# Altium schematic sheet Interface.SchDoc
size A; SheetNumber: 3; SheetTotal: 4
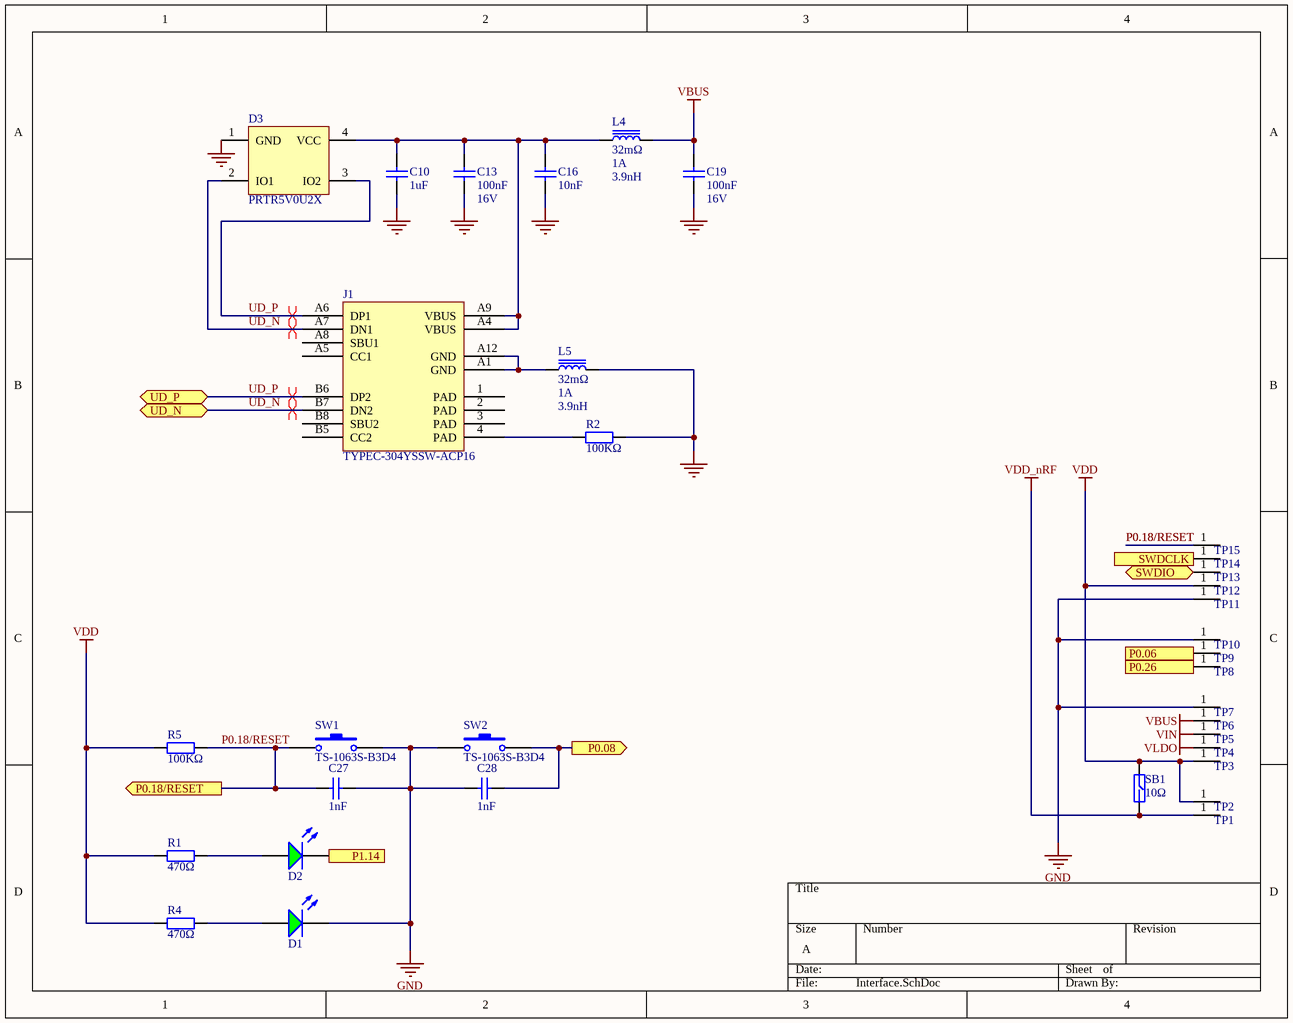
[diagram p0: Interface.SchDoc]

## Parts
C10  value 1uF  [0603_C]  (hidden comment: 1uF (105) 10% 50V)
C13  value 100nF  Voltage: 16V  [0402_C]  (hidden comment: 100nF (104) 10% 16V)
C16  value 10nF  [0402_C]  (hidden comment: 10nF (103) 10% 50V)
C19  value 100nF  Voltage: 16V  [0402_C]  (hidden comment: 100nF (104) 10% 16V)
C27  value 1nF  [0402_C]  (hidden comment: 1nF (102) 10% 50V)
C28  value 1nF  [0402_C]  (hidden comment: 1nF (102) 10% 50V)
D1  0603 LED Green  [0603_LED_S1]  (value not drawn)
D2  0603 LED Green  [0603_LED_S1]  (value not drawn)
D3  PRTR5V0U2X  [SOT190P230X110-4L]
J1  TYPEC-304YSSW-ACP16  [TYPEC-304YSSW-ACP16]
L4  value 3.9nH  DC Resistance: 32mΩ  Current: 1A  [0603_L]  (hidden comment: LQW18AN3N9C10D)
L5  value 3.9nH  DC Resistance: 32mΩ  Current: 1A  [0603_L]  (hidden comment: LQW18AN3N9C10D)
R1  value 470Ω  [0402_R]  (hidden comment: 470Ω (4700) ±1%)
R2  value 100KΩ  [0402_R]  (hidden comment: 100KΩ (1003) ±1%)
R4  value 470Ω  [0402_R]  (hidden comment: 470Ω (4700) ±1%)
R5  value 100KΩ  [0402_R]  (hidden comment: 100KΩ (1003) ±1%)
SB1  10Ω  [0603-FUSE]
SW1  TS-1063S-B3D4  [TS-1063S-B3D4]
SW2  TS-1063S-B3D4  [TS-1063S-B3D4]
TP1  Test Point  [TP_H_24_80_36]  (value not drawn)  (net tie, no BOM)
TP2  Test Point  [TP_H_24_80_36]  (value not drawn)  (net tie, no BOM)
TP3  Test Point  [TP_H_24_80_36]  (value not drawn)  (net tie, no BOM)
TP4  Test Point  [TP_H_24_80_36]  (value not drawn)  (net tie, no BOM)
TP5  Test Point  [TP_H_24_80_36]  (value not drawn)  (net tie, no BOM)
TP6  Test Point  [TP_H_24_80_36]  (value not drawn)  (net tie, no BOM)
TP7  Test Point  [TP_H_24_80_36]  (value not drawn)  (net tie, no BOM)
TP8  Test Point  [TP_H_24_80_36]  (value not drawn)  (net tie, no BOM)
TP9  Test Point  [TP_H_24_80_36]  (value not drawn)  (net tie, no BOM)
TP10  Test Point  [TP_H_24_80_36]  (value not drawn)  (net tie, no BOM)
TP11  Test Point  [TP_H_24_80_36]  (value not drawn)  (net tie, no BOM)
TP12  Test Point  [TP_H_24_80_36]  (value not drawn)  (net tie, no BOM)
TP13  Test Point  [TP_H_24_80_36]  (value not drawn)  (net tie, no BOM)
TP14  Test Point  [TP_H_24_80_36]  (value not drawn)  (net tie, no BOM)
TP15  Test Point  [TP_H_24_80_36]  (value not drawn)  (net tie, no BOM)

## Ports
P0.06 (out, see Collection[3D], Controller[1B]), P0.08 (out, see Collection[3D], Controller[1B]), P0.18/RESET (out, see Collection[2D], Controller[2C]), P0.26 (in, see Collection[3D], Controller[1B]), P1.14 (in, see Collection[3D], Controller[2A]), SWDCLK (out, see Collection[2D], Controller[3C]), SWDIO (bidir, see Collection[2D], Controller[3C]), UD_N (bidir, see Collection[2D]), UD_P (bidir, see Collection[2D])

## Nets
GND: C10.1 C13.1 C16.1 C19.1 C27.2 C28.1 D1.K D3.1(GND) L5.2 R2.2 SW1.2 SW2.1 TP7.1(TP) TP10.1(TP) TP11.1(TP)
VBUS: C19.2 L4.2 TP6.1(TP)
VDD: R1.1 R4.1 R5.1 SB1.1 TP2.1(TP) TP3.1(TP) TP12.1(TP)
VDD_nRF: SB1.2 TP1.1(TP)
VIN: TP5.1(TP)
VLDO: TP4.1(TP)
P0.06: TP9.1(TP) ; port P0.06
P0.08: C28.2 SW2.2 ; port P0.08
P0.18/RESET: C27.1 R5.2 SW1.1 TP15.1(TP) ; port P0.18/RESET
P0.26: TP8.1(TP) ; port P0.26
P1.14: D2.K ; port P1.14
SWDCLK: TP14.1(TP) ; port SWDCLK
SWDIO: TP13.1(TP) ; port SWDIO
UD_N: D3.2(IO1) J1.A7(DN1) J1.B7(DN2) ; port UD_N
UD_P: D3.3(IO2) J1.A6(DP1) J1.B6(DP2) ; port UD_P
NetC10_2: C10.2 C13.2 C16.2 D3.4(VCC) J1.A4(VBUS) J1.A9(VBUS) L4.1
NetD1_A: D1.A R4.2
NetD2_A: D2.A R1.2
NetJ1_4: J1.4(PAD) R2.1
NetJ1_A1: J1.A1(GND) J1.A12(GND) L5.1

Not connected (* = marked no-connect by the designer): J1 1(PAD) 2(PAD) 3(PAD) A5(CC1) A8(SBU1) B5(CC2) B8(SBU2)

## Layout directives
differential pair: UD_N, UD_P

## Library data of the parts
C10 = 0603 1uF (105) 10% 50V: Chip Capacitor; Package: 0603; Voltage: 50V
C13 C19 = 0402 100nF (104) 10% 16V: Chip Capacitor
C16 = 0402 10nF (103) 10% 50V: Chip Capacitor; Package: 0402; Voltage: 50V
C27 C28 = 0402 1nF (102) 10% 50V: Chip Capacitor; Voltage: 50V
D1 D2 = 0603 LED Green: Green LED; Package: 0603; Color: Green
D3 = PRTR5V0U2X: Ultra low capacitance double rail-to-rail ESD protection diode; Manufacturer: NXP Semiconductors; Part number IPS: 00000009951; Note: N.A.; Artikkelnr Noca: 10069015; Pad Count: 4; Part Number: PRTR5V0U2X; Manufacturer Part Number: PRTR5V0U2X; LatestRevisionDate: 2017-11-09; Publisher: Nordic Semiconductor; Published: 2012-06-11; Value: PRTR5V0U2X; Footprint Doc: SOT-143B; ComponentLink1URL: N.A.; ComponentLink1Description: Datasheet; ComponentLink2URL: N.A.; ComponentLink2Description: Supplier link; HelpURL: http://www.farnell.com/datasheets/109718.pdf; Pin Count: 4; Supplier 1: Digi-Key; Supplier Part Number 1: 568-4140-1-ND; Supplier 2: Farnell; Supplier Part Number 2: 152-4157; Author: rsk; Component Class: Semiconductors; PartId: 101300082; Part number Norautron: N.A.
J1 = TYPEC-304YSSW-ACP16: 5A16PIN TYPEC
L4 L5 = LQW18AN3N9C10D: 1A 3.9nH 32mΩ 0603  Inductors (SMD) ROHS; Package: 0603
R1 R4 = 0402 470Ω (4700) 1%: Chip Resistor; Package: 0402
R2 R5 = 0402 100KΩ (1003) 1%: Chip Resistor; Package: 0402
SB1 = Test-Fuse: Fuse easy soldering for test, with 10Ω 0603 Resistor soldered
SW1 SW2 = TS-1063S-B3D4: SPST 250gf@±30gf -  Tactile Switches ROHS
TP1-TP15 = Test-Point